# EAGLE design modulator (EAGLE 6.4)
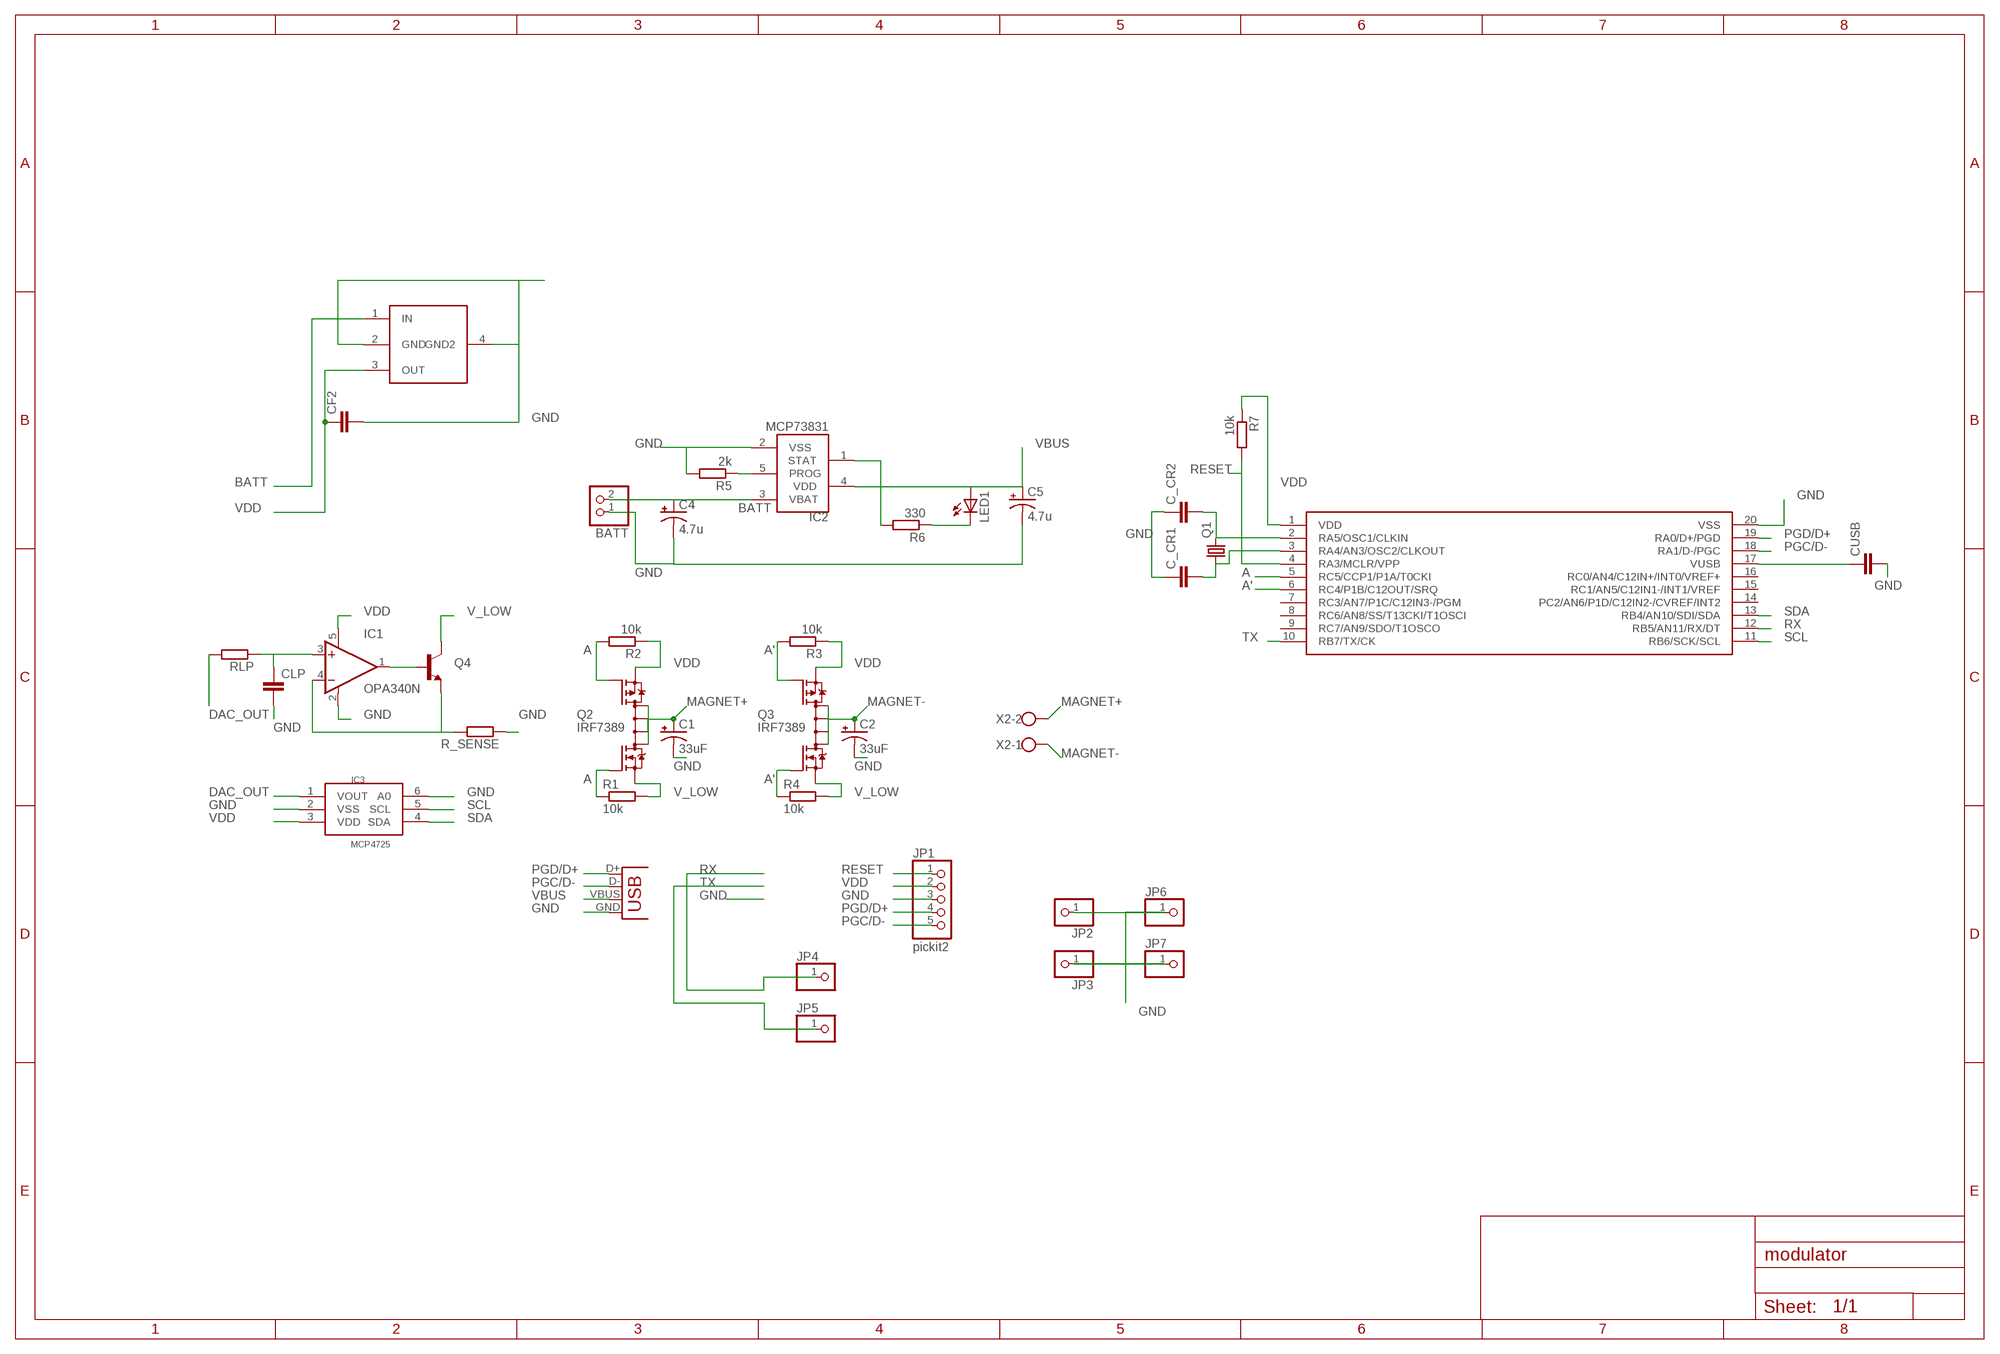
[diagram p0: schematic, sheet 1]

## Parts
BATT  PINHD-1X2  [1X02]
C1  33uF  CPOL-USB/3528-21W  [B/3528-21W]
C2  33uF  CPOL-USB/3528-21W  [B/3528-21W]
C4  4.7u  CPOL-USB/3528-21W  [B/3528-21W]
C5  4.7u  CPOL-USB/3528-21W  [B/3528-21W]
C_CR1  C-EUC1206  [C1206]
C_CR2  C-EUC1206  [C1206]
CF2  C-EUC1206  [C1206]
CLP  C-EUC1206  [C1206]
CUSB  C-EUC1206  [C1206]
IC1  OPA340N  [SOT23-5]
IC2  MCP73831  [SOT23-5L]
IC3  MCP4725  [SOT23-6]
JP1  pickit2  PINHD-1X5  [1X05]
JP2  PINHD-1X1  [1X01]
JP3  PINHD-1X1  [1X01]
JP4  PINHD-1X1  [1X01]
JP5  PINHD-1X1  [1X01]
JP6  PINHD-1X1  [1X01]
JP7  PINHD-1X1  [1X01]
LED1  LED1206  [LED-1206]
Q1  CRYSTAL5X3  [CRYSTAL-SMD-5X3]
Q2  IRF7389  [SO08-IRF]
Q3  IRF7389  [SO08-IRF]
Q4  TRANSISTOR_NPNSOT23  [SOT23]
R1  10k  R-EU_R1206W  [R1206W]
R2  10k  R-EU_R1206W  [R1206W]
R3  10k  R-EU_R1206W  [R1206W]
R4  10k  R-EU_R1206W  [R1206W]
R5  2k  R-EU_R1206W  [R1206W]
R6  330  R-EU_R1206W  [R1206W]
R7  10k  R-EU_R1206W  [R1206W]
R_SENSE  R-EU_R1206W  [R1206W]
RLP  R-EU_R1206W  [R1206W]
U$1  PIC18F4X  [SSOP20]
U$3  MCP1826S  [SOT223]
X1  USB-SMD-NS  [USB-MINIB-NOSTOP]
X2  W237-102  [W237-102]

## Nets
A: Q2.2(N-G) Q2.4(P-G) R1.1 R2.2 U$1.5(RC5/CCP1/P1A/T0CKI)
A': Q3.2(N-G) Q3.4(P-G) R3.2 R4.1 U$1.6(RC4/P1B/C12OUT/SRQ)
BATT: BATT.2 C4.+ IC2.3(VBAT) U$3.1(IN)
DAC_OUT: IC3.1(VOUT) RLP.2
GND: BATT.1 C1.- C2.- C4.- C5.- C_CR1.1 C_CR2.1 CF2.2 CLP.2 CUSB.2 IC1.2(V-) IC2.2(VSS) IC3.2(VSS) IC3.6(A0) JP1.3 JP2.1 JP3.1 JP6.1 JP7.1 R5.2 R_SENSE.1 U$1.20(VSS) U$3.2(GND) U$3.4(GND2) X1.GND
MAGNET+: C1.+ Q2.5(D) Q2.6(D) Q2.7(D) Q2.8(D) X2.2
MAGNET-: C2.+ Q3.5(D) Q3.6(D) Q3.7(D) Q3.8(D) X2.1
N$1: IC1.1(OUT) Q4.1(B)
N$2: IC1.4(-IN) Q4.2(E) R_SENSE.2
N$5: CLP.1 IC1.3(+IN) RLP.1
N$7: CUSB.1 U$1.17(VUSB)
N$9: IC2.5(PROG) R5.1
N$10: C_CR1.2 Q1.1 U$1.3(RA4/AN3/OSC2/CLKOUT)
N$11: C_CR2.2 Q1.3 U$1.2(RA5/OSC1/CLKIN)
N$12: LED1.C R6.1
N$14: IC2.1(STAT) R6.2
PGC/D-: JP1.5 U$1.18(RA1/D-/PGC) X1.D-
PGD/D+: JP1.4 U$1.19(RA0/D+/PGD) X1.D+
RESET: JP1.1 R7.2 U$1.4(RA3/MCLR/VPP)
RX: JP4.1 U$1.12(RB5/AN11/RX/DT)
SCL: IC3.5(SCL) U$1.11(RB6/SCK/SCL)
SDA: IC3.4(SDA) U$1.13(RB4/AN10/SDI/SDA)
TX: JP5.1 U$1.10(RB7/TX/CK)
V_LOW: Q2.1(N-S) Q3.1(N-S) Q4.3(C) R1.2 R4.2
VBUS: C5.+ IC2.4(VDD) LED1.A X1.VBUS
VDD: CF2.1 IC1.5(V+) IC3.3(VDD) JP1.2 Q2.3(P-S) Q3.3(P-S) R2.1 R3.1 R7.1 U$1.1(VDD) U$3.3(OUT)
Unconnected: U$1.7(RC3/AN7/P1C/C12IN3-/PGM) U$1.8(RC6/AN8/SS/T13CKI/T1OSCI) U$1.9(RC7/AN9/SDO/T1OSCO) U$1.14(PC2/AN6/P1D/C12IN2-/CVREF/INT2) U$1.15(RC1/AN5/C12IN1-/INT1/VREF) U$1.16(RC0/AN4/C12IN+/INT0/VREF+)

## Library data of the parts
BATT = pinhead:PINHD-1X2: PIN HEADER
C1 C2 C4 C5 = resistor:CPOL-US: POLARIZED CAPACITOR, American symbol
C_CR1 C_CR2 CF2 CLP CUSB = rcl:C-EU: CAPACITOR, European symbol
IC1 = burr-brown:OPA340: Rail-to-Rail Operational Amplifiers Single-Supply, MicroAmplifier(TM) Series
IC2 = microchip-update:MCP73831: Miniature Single-Cell, Fully Integrated Li-Ion, Li-Polymer Charge Management Controllers
IC3 = microchip-update:MCP4725: 12-Bit Digital-to-Analog Converter with EEPROM Memory in SOT-23-6
JP1 = pinhead:PINHD-1X5: PIN HEADER
JP2-JP7 = pinhead:PINHD-1X1: PIN HEADER
LED1 = SparkFun:LED: LEDs Standard schematic elements and footprints for 5mm, 3mm, 1206, and 0603 sized LEDs. 5mm - Spark Fun Electronics SKU : COM-00529 (and others)
Q1 = SparkFun:CRYSTAL: Crystals Various standard crystals. Proven footprints. Spark Fun Electronics SKU : COM-00534
Q2 Q3 = transistor-fet-modified:IRF7389: Complimentary Half Bridge HEXFET Power MOSFET Source: http://www.irf.com/product-info/datasheets/data/irf7389.pdf
Q4 = SparkFun:TRANSISTOR_NPN: Transistor NPN BJT configuration in SOT23 package. MMBT2222 is the common NPN we use. Double check BCE configuration again layout.
R1-R7 R_SENSE RLP = rcl:R-EU_: RESISTOR, European symbol
U$1 = SparkFun:PIC18F4X
U$3 = SparkFun:MCP1826S
X1 = SparkFun:USB: USB Connectors USB-B-PTH is fully proven SKU : PRT-00139 USB-miniB is fully proven SKU : PRT-00587 USB-A-PCB is untested. USB-A-H is throughly reviewed, but untested. Spark Fun Electronics SKU : PRT-00437 USB-B-SMT is throughly reviewed, but untested. Needs silkscreen touching up. USB-A-S has not been used/tested USB-MB-H has not been used/tested
X2 = con-wago-500:W237-102: WAGO SCREW CLAMP

## Board
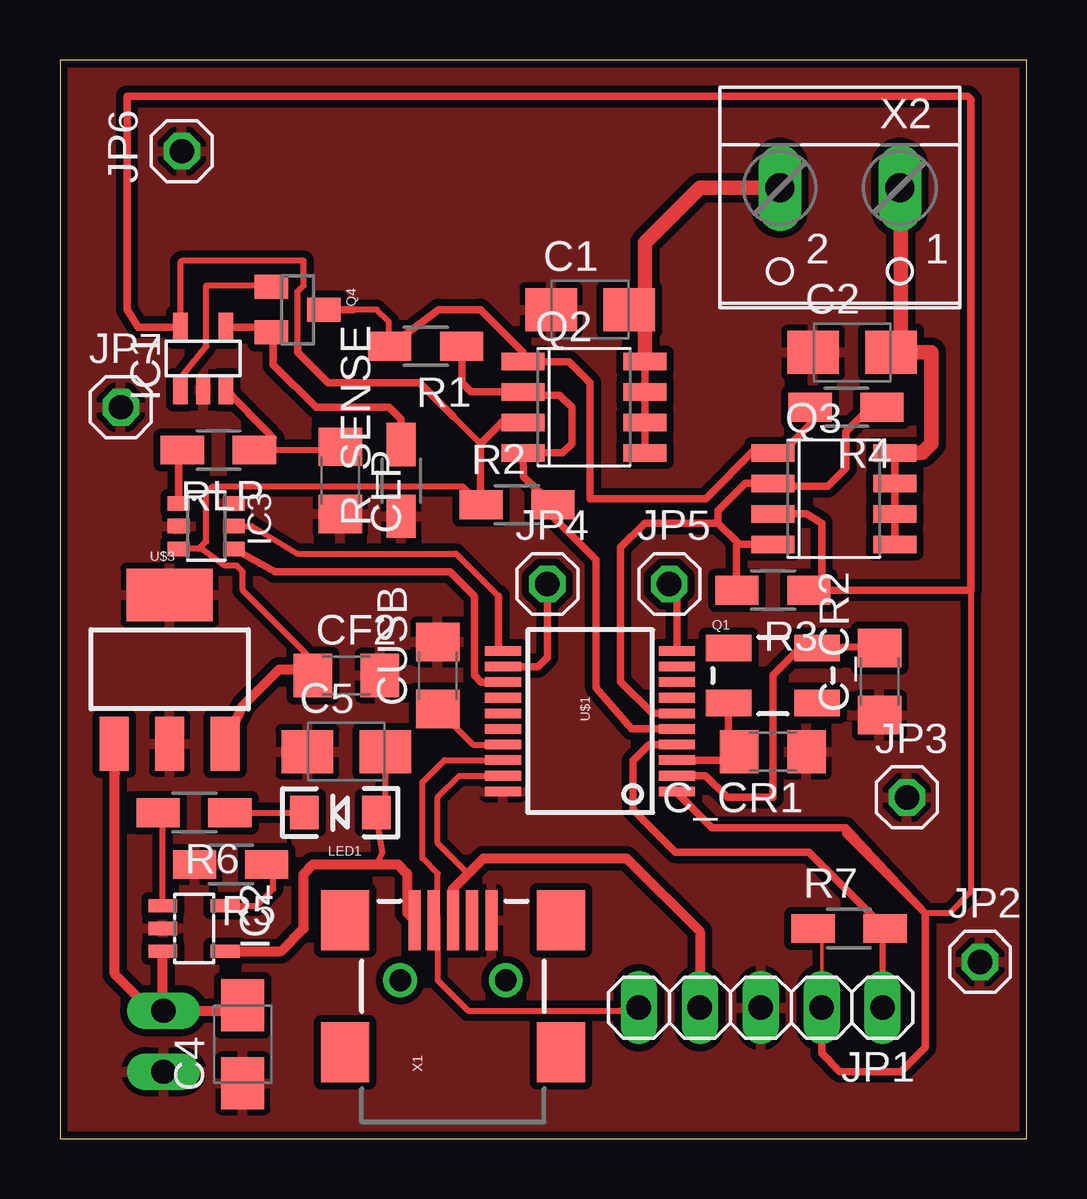
[diagram p1: board, top side]
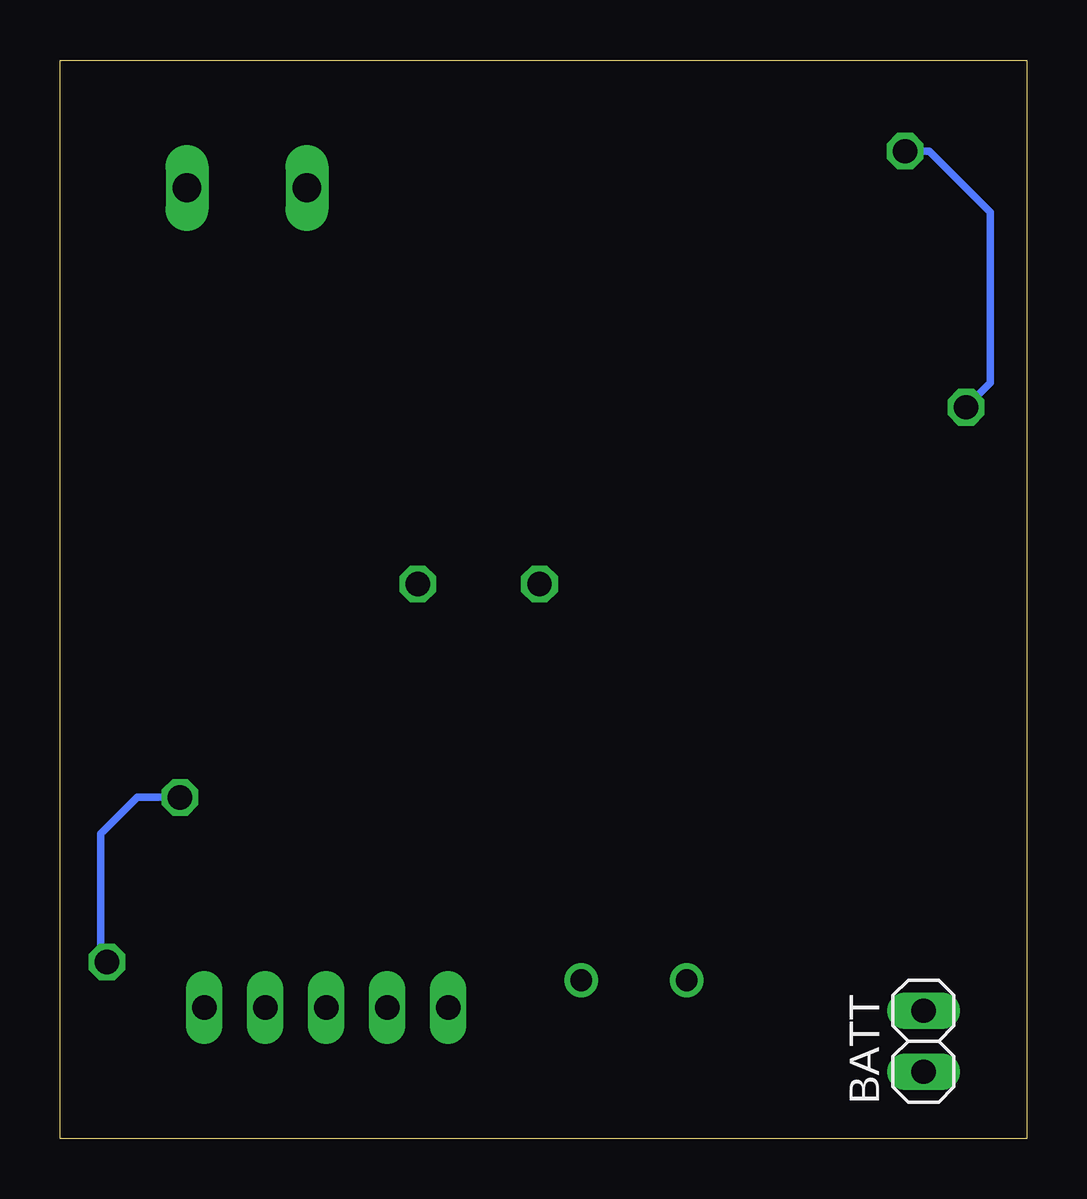
[diagram p2: board, bottom side, seen from below]

Size 40.31 x 44.95 mm. Coordinates in mm from the lower left corner, seen from the top.
Outline: 0,0 40.31,0 40.31,44.95 0,44.95 0,0
Copper layers (1*16): Top 0.035mm / dielectric 1.5mm / Bottom 0.035mm
Design rules "Fusion_eagle_rule_v1.1": minimum track width 6mil, minimum drill 12mil, track to track 6mil, track to pad 6mil, pad to pad 6mil, via to via 6mil, smd to smd 0mil, copper to edge 10mil, drill to drill 10mil, minimum pad ring 10mil, minimum via ring 6mil, stop-mask expansion 2mil, vias tented up to drill 100mil, thermal gap 10mil

### Footprints (pad centres in the part's own frame; a part is rotated, then mirrored left to right if it is on the bottom)
1X02 = drill 1.016 long: 1 -1.27,0; 2 1.27,0
B/3528-21W = smd 2.15 x 1.8: + 1.625,0; - -1.625,0
C1206 = smd 1.6 x 1.8: 1 -1.4,0; 2 1.4,0
SOT23-5 = smd 0.6 x 1.2: 1 -0.95,-1.306; 2 0,-1.306; 3 0.95,-1.306; 4 0.95,1.306; 5 -0.95,1.306
SOT23-5L = smd 0.55 x 1.2: 1 -0.95,-1.3; 2 0,-1.3; 3 0.95,-1.3; 4 0.95,1.3; 5 -0.95,1.3
SOT23-6 = smd 0.6 x 0.9: 1 -0.95,-1.15; 2 0,-1.15; 3 0.95,-1.15; 4 0.95,1.15; 5 0,1.15; 6 -0.95,1.15
1X05 = drill 1.016 long: 1 -5.08,0; 2 -2.54,0; 3 0,0; 4 2.54,0; 5 5.08,0
1X01 = drill 1.016 octagon: 1 0,0
LED-1206 = smd 1.2 x 1.4: A -1.5,0; C 1.5,0
CRYSTAL-SMD-5X3 = smd 1.9 x 1.1: 1 -1.85,-1.15; 2 1.85,-1.15; 3 1.85,1.15; 4 -1.85,1.15
SO08-IRF = smd 0.72 x 1.78: 1 -1.905,-2.543; 2 -0.635,-2.543; 3 0.635,-2.543; 4 1.905,-2.543; 5 1.905,2.543; 6 0.635,2.543; 7 -0.635,2.543; 8 -1.905,2.543
SOT23 = smd 1 x 1.4: 1 -0.95,-1.1; 2 0.95,-1.1; 3 0,1.1
R1206W = smd 1.8 x 1.2: 1 -1.499,0; 2 1.499,0
SSOP20 = smd 0.4 x 1.5: 1 -2.925,-3.625; 2 -2.275,-3.625; 3 -1.625,-3.625; 4 -0.975,-3.625; 5 -0.325,-3.625; 6 0.325,-3.625; 7 0.975,-3.625; 8 1.625,-3.625; 9 2.275,-3.625; 10 2.925,-3.625; 11 2.925,3.625; 12 2.275,3.625; 13 1.625,3.625; 14 0.975,3.625; 15 0.325,3.625; 16 -0.325,3.625; 17 -0.975,3.625; 18 -1.625,3.625; 19 -2.275,3.625; 20 -2.925,3.625
SOT223 = smd 1.219 x 2.235: 1 -2.311,-3.099; 2 0,-3.099; 3 2.311,-3.099 | smd 3.6 x 2.2: 4 0,3.099
USB-MINIB-NOSTOP = smd 2.5 x 0.5: D+ 2.5,0; D- 2.5,0.8; GND 2.5,-1.6; ID 2.5,-0.8; VBUS 2.5,1.6 | smd 2.5 x 2: G1 -3,-4.5; G2 -3,4.5; G3 2.5,4.5; G4 2.5,-4.5 | drill 0.9 pad 0.8: H1 0,2.2 | drill 0.9 pad 0.787: H2 0,-2.2
W237-102 = drill 1.194 long: 1 -2.5,-1.27; 2 2.5,-1.27

### Placement (x,y rotation side)
BATT  4.32,4.06 90 bottom
C1  22.1,34.54 0 top
C2  33.02,32.77 0 top
C4  7.62,3.94 90 top
C5  11.94,16.13 0 top
C_CR1  29.72,16.13 180 top
C_CR2  34.16,19.05 90 top
CF2  11.94,19.3 0 top
CLP  11.68,27.43 270 top
CUSB  15.75,19.3 90 top
IC1  5.97,32.51 0 top
IC2  5.59,8.76 270 top
IC3  6.1,25.53 270 top
JP1  29.21,5.46 180 top
JP2  38.35,7.37 0 top
JP3  35.31,14.22 0 top
JP4  20.32,23.11 0 top
JP5  25.4,23.11 0 top
JP6  5.08,41.15 90 top
JP7  2.54,30.48 0 top
LED1  11.68,13.59 180 top
Q1  29.72,19.3 0 top
Q2  21.84,30.48 270 top
Q3  32.26,26.67 270 top
Q4  9.91,34.54 270 top
R1  15.24,33.02 180 top
R2  19.05,26.42 0 top
R3  29.72,22.86 180 top
R4  32.77,30.48 180 top
R5  7.11,11.43 180 top
R6  5.59,13.59 180 top
R7  32.89,8.76 0 top
R_SENSE  14.22,27.43 90 top
RLP  6.6,28.7 180 top
U$1  22.1,17.4 90 top
U$3  4.57,19.56 0 top
X1  16.38,6.6 90 top
X2  32.51,38.35 180 top

### Tracks (layer width: path | path; a pad name or v marks a point on that pad's centre or on a via)
A
  Top 0.305: U$1.5 23.82,17.07 22.35,18.8 22.35,24.13 20.6,25.88 R2.2 19.33,27.59 Q2.4 | Q2.4 19.43,28.45 | Q2.4 19.33,28.55 | R1.1 16.76,32.49 16.76,31.5 17.14,31.12 Q2.2 19.43,30.99 20.83,30.99 21.34,30.48 21.34,28.96 20.95,28.58 Q2.4
A'
  Top 0.305: U$1.6 24.69,17.72 23.37,19.05 23.37,24.64 24.38,25.65 27.43,25.65 | 27.43,25.65 28.19,24.89 | 28.19,24.89 28.19,22.89 R3.2 | Q3.4 28.32,24.77 28.19,24.89 | 27.43,25.65 27.43,26.16 28.57,27.3 Q3.2 29.84,27.18 32,27.18 32.77,27.94 32.77,29.46 33.78,30.48 R4.1
BATT
  Top 0.406: BATT.2 7.85,5.33 C4.+ | BATT.2 4.32,5.24 4.29,5.24 IC2.3 | BATT.2 3.81,5.33 2.29,6.86 2.29,15.21 U$3.1
DAC_OUT
  Top 0.305: IC3.1 4.95,28.35 RLP.2
GND
  Bottom 0.305: JP6.1 4.06,41.15 1.52,38.61 1.52,31.5 JP7.1 | JP3.1 37.08,14.22 38.61,12.7 38.61,7.62 JP2.1
  pour Top (isolate 0.305): 40.39,0 0,0 0,44.7 40.39,44.7
MAGNET+
  Top 0.305: 24.38,28.7 24.38,28.45 24.39,28.45 Q2.5 24.39,28.7 24.38,28.7 | 24.38,28.7 Q2.6 Q2.7 Q2.8
  Top 0.61: C1.+ 24.39,33.88 Q2.8 24.39,37.34 26.67,39.62 X2.2
MAGNET-
  Top 0.305: Q3.5 Q3.6 Q3.7 Q3.8
  Top 0.61: Q3.8 35.94,28.58 36.32,28.96 36.32,32.77 C2.+ 34.8,32.77 35.05,33.02 35.05,39.58 X2.1
N$1
  Top 0.254: IC1.1 5.02,31.69 6.1,33.02 6.1,35.56 8.74,35.56 Q4.1
N$2
  Top 0.305: IC1.4 8.52,33.82 Q4.2 8.81,33.36 8.89,33.27 8.89,32.26 10.67,30.48 13.72,30.48 14.22,29.97 R_SENSE.2
N$5
  Top 0.254: 8.38,28.7 11.56,28.7 CLP.1
  Top 0.305: 8.38,28.7 RLP.1 8.89,29.19 8.64,29.46 8.16,29.94 IC1.3
N$7
  Top 0.254: U$1.17 17.23,16.42 CUSB.1
N$9
  Top 0.254: 7.09,9.71 8.19,9.71 8.89,10.41 8.89,11.4 R5.1
  Top 0.406: IC2.5 7.09,9.71
N$10
  Top 0.305: U$1.3 27.96,15.77 C_CR1.2 27.87,16.58 Q1.1
N$11
  Top 0.305: U$1.2 26.91,15.12 27.81,14.22 29.72,14.22 29.72,19.3 30.99,20.57 31.45,20.57 Q1.3 33.6,20.51 C_CR2.2
N$12
  Top 0.254: R6.1 LED1.C
N$14
  Top 0.254: IC2.1 4.29,13.39 R6.2
PGC/D-
  Top 0.254: JP1.5 23.37,5.33 17.02,5.33 15.75,6.6 15.75,9.27 | U$1.18 16.03,15.77 15.11,14.86 15.11,11.68 15.75,11.05 15.75,9.27 | X1.D- 15.75,9.27
PGD/D+
  Top 0.254: U$1.19 16.65,15.12 15.75,14.22 15.75,12.32 17.02,11.05
  Top 0.406: X1.D+ 16.38,10.41 17.02,11.05 17.65,11.68 23.62,11.68 26.67,8.64 JP1.4
RESET
  Top 0.254: JP1.1 34.29,8.66 R7.2
  Top 0.305: U$1.4 24.55,16.42 23.88,15.75 23.88,13.72 25.65,11.94 31.22,11.94 R7.2
RX
  Top 0.305: U$1.12 19.93,19.67 20.32,20.07 JP4.1
SCL
  Top 0.254: IC3.5 8,25.53 9.91,24.38 16.51,24.38 18.29,22.61
  Top 0.305: 18.29,22.61 18.29,20.51 U$1.11
SDA
  Top 0.305: U$1.13 17.55,19.02 17.27,19.3 17.27,22.61 16.26,23.62 8.96,23.62 IC3.4
TX
  Top 0.305: U$1.10 25.72,22.79 JP5.1
V_LOW
  Top 0.254: 12.22,34.54 13.21,34.54 13.72,34.04 13.72,33.04 R1.2
  Top 0.305: 13.49,33.02 R1.2 15.77,34.54 17.53,34.54 19.3,32.77 Q2.1 21.21,32.38 22.1,31.5 22.1,26.67 26.92,26.67 28.96,28.7 29.59,28.7 Q3.1 29.84,28.7 30.23,28.7 31.27,29.74 R4.2 | 12.22,34.54 Q4.3
VBUS
  Top 0.254: 13.21,11.43 13.44,11.91 LED1.A 13.56,13.71 C5.+
  Top 0.406: IC2.4 9.21,7.81 10.16,8.76 10.16,11.05 10.54,11.43 13.21,11.43 14.1,11.43 14.48,11.05 14.48,9.41 X1.VBUS
VDD
  Top 0.152: R7.1 31.75,8.89 JP1.2 | R3.1 30.99,23.11
  Top 0.254: IC1.5 5.02,36.52 5.08,36.58 10.16,36.58 10.16,35.56 9.91,35.31 9.91,33.02 | 17.53,28.96 16.38,30.1 16.26,30.23 | R7.1 31.22,8.94 | 5.78,24.58 IC3.3 | 5.78,24.58 6.1,24.89 6.1,26.92 6.35,27.18 16.79,27.18 R2.1 | 5.78,24.58 5.9,24.58 6.86,23.88 7.37,23.88 7.62,23.62 7.62,22.86 10.41,20.07 10.67,19.43 CF2.1 | 37.97,22.86 37.97,10.29 37.08,9.4 36.07,9.4
  Top 0.305: 26.36,13.77 U$1.1 25.72,14.41 26.36,13.77 | Q3.3 31.11,26.04 31.75,25.65 31.75,23.14 R3.1 37.97,22.86 37.97,43.31 37.85,43.43 2.79,43.43 2.79,34.54 3.27,33.82 IC1.5 | 18.29,29.72 19.17,29.72 Q2.3 18.41,29.85 18.29,29.72 | 17.53,26.7 17.53,28.96 18.29,29.72 | R2.1 17.53,26.7 | 17.53,26.7 17.53,26.67 | 26.36,13.77 27.18,12.95 32.77,12.95 | 36.07,9.4 32.77,12.95 | 36.07,9.4 36.07,3.81 35.05,2.79 32.51,2.79 31.75,3.56 JP1.2 | 32.77,12.95 32.77,12.7 36.07,9.4 | 9.91,33.02 9.91,32.77 11.18,31.5 14.99,31.5 16.38,30.1
  Top 0.406: U$3.3 7.64,18.06 9.14,19.56 10.28,19.56 CF2.1